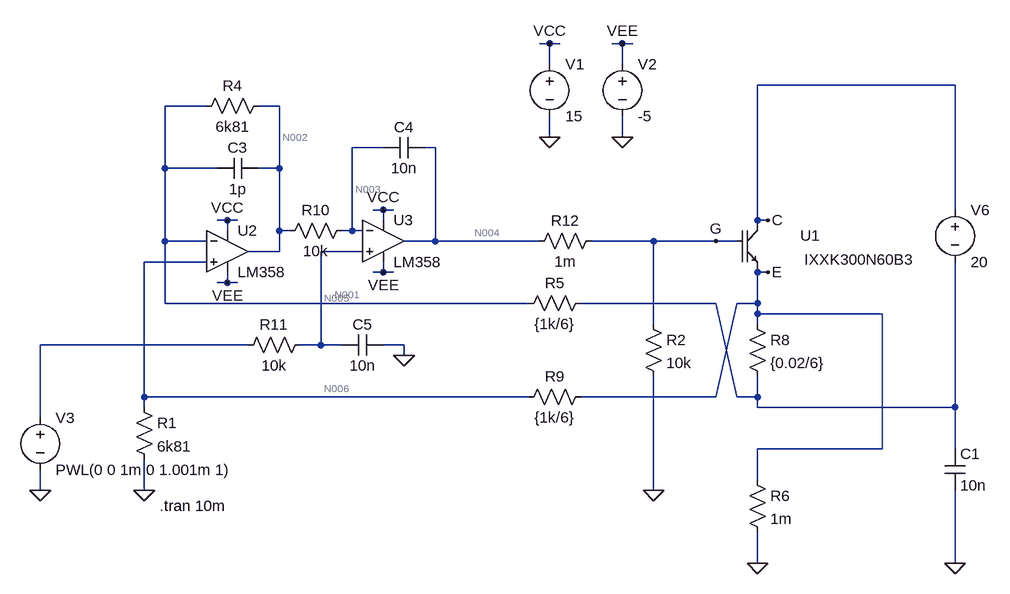
[diagram p0: schematic ConstantCurrentRTN-COMPath.asc]
* ConstantCurrentRTN-COMPath.asc
XU1 C G E IXXK300N60B3 IXXK300N60B3  ; pins C G E
R2 G 0 10k
* U2: LM358 (symbol LM358 not available, pins judged from their places): In+=N006 In-=N001 V+=VCC V-=VEE OUT=N002
V1 VCC 0 15
V2 VEE 0 -5
V3 N008 0 PWL(0 0 1m 0 1.001m 1)
R5 N007 N001 {1k/6}
R8 E N007 {0.02/6}
C3 N002 N001 1p
R4 N002 N001 6k81
* U3: LM358 (symbol LM358 not available, pins judged from their places): In+=N005 In-=N003 V+=VCC V-=VEE OUT=N004
R9 E N006 {1k/6}
C4 N004 N003 10n
R10 N003 N002 10k
R11 N005 N008 10k
C5 0 N005 10n
V6 C N007 20
R12 G N004 1m
R1 N006 0 6k81
R6 E 0 1m
C1 N007 0 10n
.tran 10m
.lib ixxk300n60b3.lib
.backanno
.end

* Results of the author's LTspice run, read from the files saved beside the schematic
* Operating Point, zero values left out:
*   V(c) = 20 V
*   V(g) = -4.998 V
*   V(n006) = 1.628 µV
*   V(vee) = -5 V
*   V(n001) = 51.35 µV
*   V(vcc) = 15 V
*   V(n002) = 2.081 mV
*   V(n005) = 103.2 µV
*   V(n003) = 2.178 mV
*   V(n004) = -4.998 V
*   I(R2) = -499.8 µA
*   I(R5) = -308.1 nA
*   I(R8) = -96.39 nA
*   I(R4) = 298.1 nA
*   I(R9) = -9.768 nA
*   I(R10) = 9.683 nA
*   I(R11) = 10.32 nA
*   I(R12) = 499.8 µA
*   I(R1) = 239.1 pA
*   I(R6) = 317.9 nA
*   I(V1) = -689.6 µA
*   I(V2) = 1.189 mA
*   I(V3) = 10.32 nA
*   I(V6) = -211.7 nA
*   Ix(u1:C) = 211.7 nA
*   Ix(u1:E) = -211.7 nA
*   Ix(u2:1) = -9.992 nA
*   Ix(u2:2) = -10.01 nA
*   Ix(u2:3) = -288.4 nA
*   Ix(u2:4) = 344.1 µA
*   Ix(u2:5) = -343.8 µA
*   Ix(u3:1) = -9.683 nA
*   Ix(u3:2) = -10.32 nA
*   Ix(u3:3) = 499.8 µA
*   Ix(u3:4) = 345.5 µA
*   Ix(u3:5) = -845.2 µA
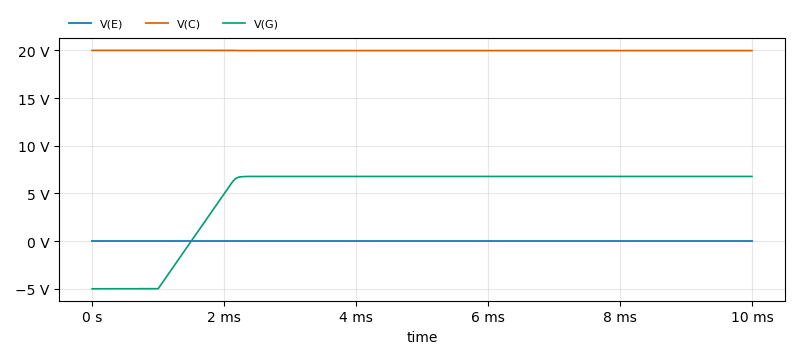
[diagram p1: Transient Analysis of ConstantCurrentRTN-COMPath.asc, plotted from the saved traces]
* Transient Analysis, 1 run:
*   V(E): min 317.9 pV, max 154.3 nV, average 130.9 nV, rms 138 nV, last 146.9 nV
*   V(C): min 19.98 V, max 20 V, average 19.98 V, rms 19.98 V, last 19.98 V
*   V(G): min -4.998 V, max 6.783 V, average 4.907 V, rms 6.317 V, last 6.783 V